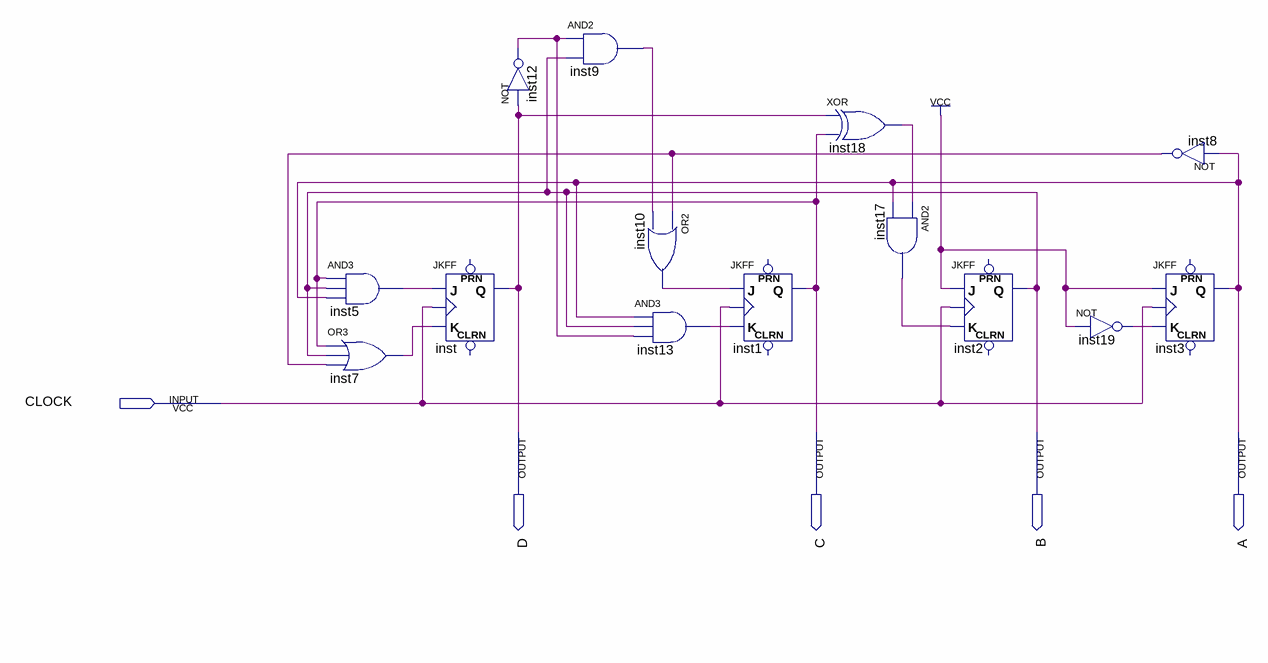
[diagram p0: schematic sheet]
// Quartus schematic LAB5_BaiTapTrenLop.bdf as structural Verilog: 14 symbols, 5 pins
module LAB5_BaiTapTrenLop (
  input  CLOCK,
  output D,
  output C,
  output B,
  output A
);

  wire inst5_out, inst7_out, inst8_out, inst9_out, inst10_out, inst12_out, inst13_out, inst17_out,
       inst18_out, inst19_out;

  and inst5 (inst5_out, C, B, A);
  or inst7 (inst7_out, C, B, inst8_out);
  JKFF inst (.K(inst7_out), .J(inst5_out), .CLK(CLOCK), .Q(D));  // open: PRN, CLRN
  not inst12 (inst12_out, D);
  and inst9 (inst9_out, inst12_out, B);
  or inst10 (inst10_out, inst8_out, inst9_out);
  and inst13 (inst13_out, A, B, inst12_out);
  JKFF inst1 (.K(inst13_out), .J(inst10_out), .CLK(CLOCK), .Q(C));  // open: PRN, CLRN
  xor inst18 (inst18_out, D, C);
  and inst17 (inst17_out, inst18_out, A);
  JKFF inst2 (.K(inst17_out), .J(1'b1), .CLK(CLOCK), .Q(B));  // open: PRN, CLRN
  not inst19 (inst19_out, 1'b1);
  not inst8 (inst8_out, A);
  JKFF inst3 (.K(inst19_out), .J(1'b1), .CLK(CLOCK), .Q(A));  // open: PRN, CLRN
endmodule
